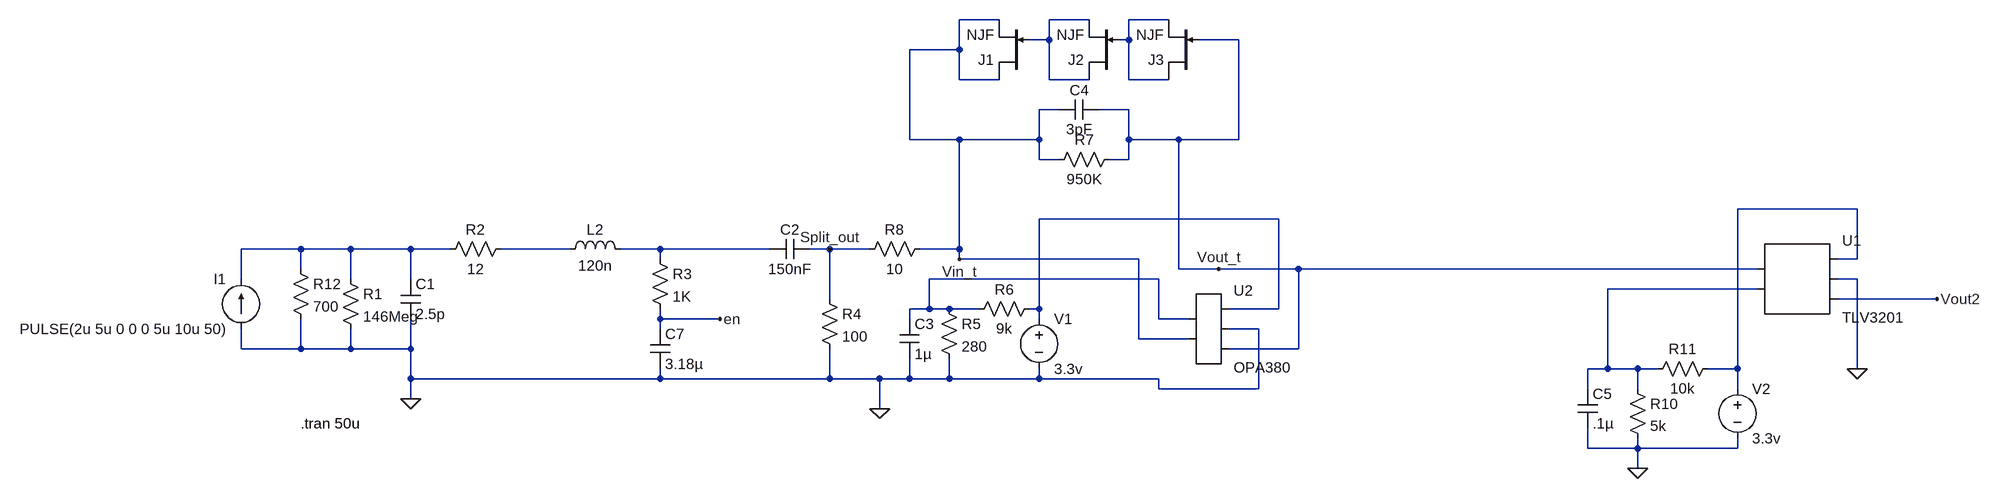
[diagram p0: schematic communication_reciver_design_1.asc]
communication_reciver_design_1.asc, the LTspice schematic file:
Version 4
SHEET 1 2032 752
WIRE 448 16 384 16
WIRE 592 16 528 16
WIRE 720 16 656 16
WIRE 528 48 528 16
WIRE 528 48 496 48
WIRE 656 48 656 16
WIRE 656 48 640 48
WIRE 832 48 768 48
WIRE 384 64 384 16
WIRE 384 64 304 64
WIRE 384 112 384 64
WIRE 448 112 384 112
WIRE 528 112 528 48
WIRE 592 112 528 112
WIRE 656 112 656 48
WIRE 720 112 656 112
WIRE 544 160 512 160
WIRE 656 160 608 160
WIRE 304 208 304 64
WIRE 384 208 304 208
WIRE 512 208 512 160
WIRE 512 208 384 208
WIRE 656 208 656 160
WIRE 736 208 656 208
WIRE 832 208 832 48
WIRE 832 208 736 208
WIRE 512 240 512 208
WIRE 544 240 512 240
WIRE 656 240 656 208
WIRE 656 240 624 240
WIRE 1824 320 1632 320
WIRE 896 336 512 336
WIRE -672 384 -768 384
WIRE -592 384 -672 384
WIRE -496 384 -592 384
WIRE -432 384 -496 384
WIRE -240 384 -352 384
WIRE -96 384 -160 384
WIRE 80 384 -96 384
WIRE 176 384 144 384
WIRE 240 384 176 384
WIRE 384 384 384 208
WIRE 384 384 320 384
WIRE -96 400 -96 384
WIRE 384 400 384 384
WIRE 672 400 384 400
WIRE 1824 400 1824 320
WIRE 1824 400 1792 400
WIRE -672 416 -672 384
WIRE 736 416 736 208
WIRE 800 416 736 416
WIRE 928 416 800 416
WIRE 1664 416 928 416
WIRE -768 432 -768 384
WIRE -592 432 -592 384
WIRE -496 432 -496 384
WIRE 704 432 336 432
WIRE 1824 432 1792 432
WIRE 1664 448 1424 448
WIRE 176 464 176 384
WIRE 1952 464 1792 464
WIRE 336 480 336 432
WIRE 336 480 304 480
WIRE 368 480 336 480
WIRE 416 480 368 480
WIRE 512 480 512 336
WIRE 512 480 496 480
WIRE 896 480 896 336
WIRE 896 480 816 480
WIRE -96 496 -96 480
WIRE 0 496 -96 496
WIRE 304 496 304 480
WIRE 512 496 512 480
WIRE 704 496 704 432
WIRE 752 496 704 496
WIRE -96 512 -96 496
WIRE 864 512 816 512
WIRE 672 528 672 400
WIRE 752 528 672 528
WIRE -768 544 -768 512
WIRE -672 544 -672 496
WIRE -672 544 -768 544
WIRE -592 544 -592 512
WIRE -592 544 -672 544
WIRE -496 544 -496 496
WIRE -496 544 -592 544
WIRE 928 544 928 416
WIRE 928 544 816 544
WIRE 1424 576 1424 448
WIRE 1424 576 1392 576
WIRE 1472 576 1424 576
WIRE 1504 576 1472 576
WIRE 1632 576 1632 320
WIRE 1632 576 1584 576
WIRE 1824 576 1824 432
WIRE -496 592 -496 544
WIRE -96 592 -96 576
WIRE -96 592 -496 592
WIRE 176 592 176 544
WIRE 176 592 -96 592
WIRE 256 592 176 592
WIRE 304 592 304 560
WIRE 304 592 256 592
WIRE 368 592 368 560
WIRE 368 592 304 592
WIRE 512 592 512 576
WIRE 512 592 368 592
WIRE 704 592 512 592
WIRE 704 608 704 592
WIRE 864 608 864 512
WIRE 864 608 704 608
WIRE 1392 608 1392 576
WIRE 1472 608 1472 576
WIRE 1632 608 1632 576
WIRE -496 624 -496 592
WIRE 256 640 256 592
WIRE 1392 704 1392 672
WIRE 1472 704 1472 688
WIRE 1472 704 1392 704
WIRE 1632 704 1632 688
WIRE 1632 704 1472 704
WIRE 1472 736 1472 704
FLAG -496 624 0
FLAG 800 416 Vout_t
FLAG 384 400 Vin_t
FLAG 256 640 0
FLAG 1824 576 0
FLAG 1472 736 0
FLAG 1952 464 Vout2
FLAG 0 496 en
FLAG 176 384 Split_out
SYMBOL res -608 416 R0
SYMATTR InstName R1
SYMATTR Value 146Meg
SYMBOL cap -512 432 R0
SYMATTR InstName C1
SYMATTR Value 2.5p
SYMBOL res -336 368 R90
WINDOW 0 0 56 VBottom 2
WINDOW 3 32 56 VTop 2
SYMATTR InstName R2
SYMATTR Value 12
SYMBOL current -768 512 R180
WINDOW 3 24 0 Left 2
WINDOW 0 24 80 Left 2
SYMATTR Value PULSE(2u 5u 0 0 0 5u 10u 50)
SYMATTR InstName I1
SYMATTR Value2 AC .5u 0
SYMBOL Cap 144 368 R90
WINDOW 0 0 32 VBottom 2
WINDOW 3 32 32 VTop 2
SYMATTR InstName C2
SYMATTR Value 150nF
SYMBOL ind -256 400 R270
WINDOW 0 32 56 VTop 2
WINDOW 3 5 56 VBottom 2
SYMATTR InstName L2
SYMATTR Value 120n
SYMBOL Res 160 448 R0
SYMATTR InstName R4
SYMATTR Value 100
SYMBOL Res 352 464 R0
SYMATTR InstName R5
SYMATTR Value 280
SYMBOL Res 512 464 R90
WINDOW 0 0 56 VBottom 2
WINDOW 3 32 56 VTop 2
SYMATTR InstName R6
SYMATTR Value 9k
SYMBOL Cap 288 496 R0
SYMATTR InstName C3
SYMATTR Value 1µ
SYMBOL voltage 512 480 R0
SYMATTR InstName V1
SYMATTR Value 3.3v
SYMBOL Res 640 224 R90
WINDOW 0 0 56 VBottom 2
WINDOW 3 32 56 VTop 2
SYMATTR InstName R7
SYMATTR Value 950K
SYMBOL Cap 608 144 R90
WINDOW 0 0 32 VBottom 2
WINDOW 3 32 32 VTop 2
SYMATTR InstName C4
SYMATTR Value 3pF
SYMBOL njf 496 112 R180
SYMATTR InstName J1
SYMBOL njf 640 112 R180
SYMATTR InstName J2
SYMBOL njf 768 112 R180
SYMATTR InstName J3
SYMBOL AutoGenerated/TLV3201 1728 432 R0
SYMATTR InstName U1
SYMBOL Cap 1376 608 R0
SYMATTR InstName C5
SYMATTR Value .1µ
SYMBOL Res 1456 592 R0
SYMATTR InstName R10
SYMATTR Value 5k
SYMBOL Voltage 1632 592 R0
SYMATTR InstName V2
SYMATTR Value 3.3v
SYMBOL Res 1600 560 R90
WINDOW 0 0 56 VBottom 2
WINDOW 3 32 56 VTop 2
SYMATTR InstName R11
SYMATTR Value 10k
SYMBOL AutoGenerated/OPA380 784 512 R0
SYMATTR InstName U2
SYMBOL Res -112 384 R0
SYMATTR InstName R3
SYMATTR Value 1K
SYMBOL Cap -112 512 R0
SYMATTR InstName C7
SYMATTR Value 3.18µ
SYMBOL Res -688 400 R0
SYMATTR InstName R12
SYMATTR Value 700
SYMBOL Res 336 368 R90
WINDOW 0 0 56 VBottom 2
WINDOW 3 32 56 VTop 2
SYMATTR InstName R8
SYMATTR Value 10
TEXT -672 664 Left 2 !.tran 50u

The netlist it stands for:
* communication_reciver_design_1.asc
R1 N005 0 146Meg
C1 N005 0 2.5p
R2 N006 N005 12
I1 0 N005 PULSE(2u 5u 0 0 0 5u 10u 50) AC .5u 0
C2 Split_out N007 150nF
L2 N006 N007 120n
R4 Split_out 0 100
R5 N008 0 280
R6 N004 N008 9k
C3 N008 0 1µ
V1 N004 0 3.3v
R7 Vout_t Vin_t 950K
C4 Vout_t Vin_t 3pF
J1 Vin_t N001 Vin_t NJF
J2 N001 N002 N001 NJF
J3 N002 Vout_t N002 NJF
* U1: TLV3201 (symbol AutoGenerated/TLV3201 not available, pins judged from their places): pin1=Vout_t pin2=N009 pin3=N003 pin4=0 pin5=Vout2
C5 N009 0 .1µ
R10 N009 0 5k
V2 N003 0 3.3v
R11 N003 N009 10k
* U2: OPA380 (symbol AutoGenerated/OPA380 not available, pins judged from their places): pin1=N008 pin2=Vin_t pin3=N004 pin4=0 pin5=Vout_t
R3 N007 en 1K
C7 en 0 3.18µ
R12 N005 0 700
R8 Vin_t Split_out 10
.model NJF NJF
.model PJF PJF
.lib standard.jft
.tran 50u
.backanno
.end